# Altium schematic sheet DIO45_TOP.SchDoc
size 297 x 209 mm; Revision: 0.1; SheetNumber: 1; SheetTotal: 5; Title2: DIO45_TOP
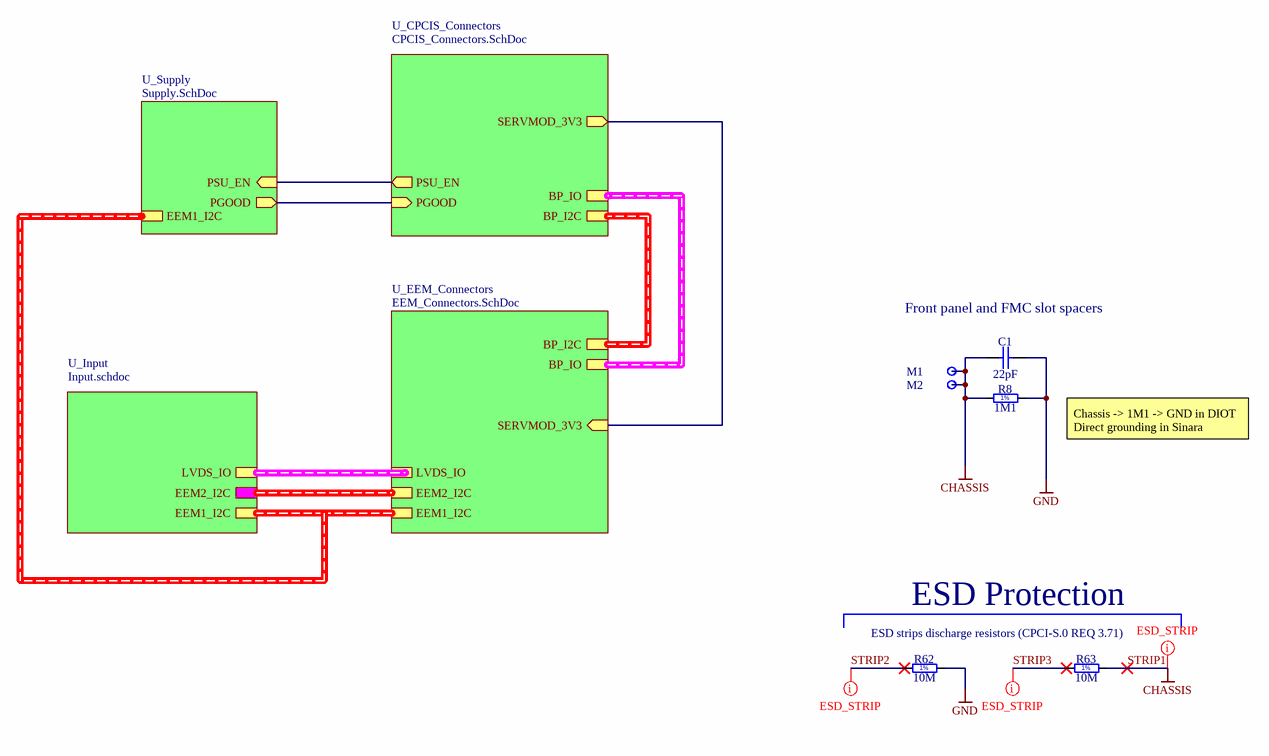
[diagram p0: DIO45_TOP.SchDoc]

## Parts
C1  22pF  [CAPC1005X55N]
M1  Plated Hole  [MTG300_600]  (value not drawn)  (no BOM)
M2  Plated Hole  [MTG300_600]  (value not drawn)  (no BOM)
R8  1M1  [RESC2012X60N]
R62  10M  [RESC2113X55N]
R63  10M  [RESC2113X55N]

## Sub-sheets
U_CPCIS_Connectors = CPCIS_Connectors.SchDoc: BP_I2C (harness I2C), SERVMOD_3V3 (out), BP_IO (harness BP_IO), PSU_EN (out), PGOOD (in)
U_EEM_Connectors = EEM_Connectors.SchDoc: EEM1_I2C (harness I2C), EEM2_I2C (harness I2C), LVDS_IO (harness LVDS_IO), BP_IO (harness BP_IO), BP_I2C (harness I2C), SERVMOD_3V3 (in)
U_Input = Input.schdoc: EEM1_I2C (harness I2C), EEM2_I2C (harness I2C), LVDS_IO (harness LVDS_IO)
U_Supply = Supply.SchDoc: PSU_EN (in), PGOOD (out), EEM1_I2C (harness I2C)

## Nets
GND: C1.2 R8.2 R62.2
STRIP1: C1.1 M1.1 M2.1 R8.1 R63.2  [also labelled CHASSIS]
STRIP2: R62.1
STRIP3: R63.1
(unnamed): sheet U_CPCIS_Connectors/SERVMOD_3V3, sheet U_EEM_Connectors/SERVMOD_3V3
(unnamed): sheet U_CPCIS_Connectors/PSU_EN, sheet U_Supply/PSU_EN
(unnamed): sheet U_CPCIS_Connectors/PGOOD, sheet U_Supply/PGOOD

## Buses and harness runs
harness sheet U_CPCIS_Connectors/BP_I2C = sheet U_EEM_Connectors/BP_I2C
harness sheet U_CPCIS_Connectors/BP_IO = sheet U_EEM_Connectors/BP_IO
harness sheet U_EEM_Connectors/EEM1_I2C = sheet U_Input/EEM1_I2C = sheet U_Supply/EEM1_I2C
harness sheet U_EEM_Connectors/EEM2_I2C = sheet U_Input/EEM2_I2C
harness sheet U_EEM_Connectors/LVDS_IO = sheet U_Input/LVDS_IO

## Layout directives
net class ESD_STRIP: STRIP1, STRIP2, STRIP3

## Notes on the sheet
- Front panel and FMC slot spacers
- Chassis -> 1M1 -> GND in DIOT
  Direct grounding in Sinara
- ESD strips discharge resistors (CPCI-S.0 REQ 3.71)
- ESD Protection
- Project/Equipment
- Document
- Designer
- Drawn by
- Check.by
- Copyright WUT ISE 2024.
  This documentation describes Open Hardware and is licensed under the CERN OHL v.2. You may redistribute and modify this documentation under the terms of the CERN OHL v.2. (http://ohwr.org/CERNOHL). This documentation is distributed WITHOUT ANY EXPRESS OR IMPLIED WARRANTY, INCLUDING OF MERCHANTABILITY, SATISFACTORY QUALITY AND FITNESS FOR A PARTICULAR PURPOSE. Please see the CERN OHL v.2 for applicable conditions.
- Contact
- File
- Last Mod.
- Print Date
- Sheet
- Size
- A3
- of
- Rev
- (in symbol R0805_1M1_1%_0.125W_100PPM) 1%
- (in symbol R0805_10M_1%_0.125W_100PPM_VISHAY_CRCW e3) 1%

## Library data of the parts
C1 = CC0402_22PF_50V_5%_C0G: Non-polarised capacitor; Part Description: SMD Multilayer Chip Ceramic Capacitor; Manufacturer: GENERIC; Manufacturer1 Part Number: C0402C220J5GACTU; Voltage: 50V; TC: C0G/NP0; Tolerance: ±5%; Part Number: CC0402_22PF_50V_5%_C0G; Component Kind: Standard; Component Type: Standard; Pin Count: 2; Value: 22pF; Status: Preferred; Manufacturer Part Number: CC0402_22PF_50V_5%_C0G; Case: 0402; Mounted: Yes; Socket: No; SMD: Yes; Manufacturer1 Example: KEMET; Manufacturer1 ComponentHeight: 0.55mm; HelpURL: \\cern.ch\dfs\Applications\Altium\Datasheets\CC0402_C0G_KEMET_(Commercial Grade).pdf; Author: CERN DEM JLC; CreateDate: 2007-12-03; LatestRevisionDate: 2007-12-03; Sense: No
M1 M2 = PLATED_HOLE3.0_PAD6.0: Single Terminal Socket; Part Description: Plated Through Hole: Hole Dia.=3.0mm Pad Dia.=6.0mm; Mounted: No; Table: Pads; Part Number: PLATED_HOLE3.0_PAD6.0; Component Type: Standard (No BOM); Designator: Single Terminal Socket; Library Reference: Single Terminal Socket; Pin Count: 1; Family: Plated Hole; Socket: No; SMD: No; Status: None; ComponentHeight: 0mm; Author: CERN DEM JLC; CreateDate: 26.05.2008; LatestRevisionDate: 26.05.2008; PackageDescription: Plated Through Hole: Hole Dia.=3.0mm Pad Dia.=6.0mm
R8 = R0805_1M1_1%_0.125W_100PPM: Resistor - 1%; Part Description: General Purpose Thick Film Chip Resistor; Manufacturer: GENERIC; Manufacturer1 Part Number: NRC10F1104TRF; PressFit: No; Part Number: R0805_1M1_1%_0.125W_100PPM; Component Kind: Standard; Component Type: Standard; Pin Count: 2; Value: 1M1; Status: Preferred; Manufacturer Part Number: R0805_1M1_1%_0.125W_100PPM; Case: 0805; Mounted: Yes; Sense: No; Socket: No; SMD: Yes; Manufacturer1 Example: NIC COMPONENT; Manufacturer1 ComponentHeight: 0.6mm; HelpURL: \\cern.ch\dfs\Applications\Altium\Datasheets\R0805_NIC_NRC.pdf; Author: CERN DEM JLC; CreateDate: 03/12/2007; LatestRevisionDate: 13/03/2008
R62 R63 = R0805_10M_1%_0.125W_100PPM_VISHAY_CRCW e3: Resistor - 1%; Part Description: 150V, Standard Thick Film Chip Resistor; Manufacturer: VISHAY DALE; Manufacturer Part Number: CRCW080510M0FKEA; Power: 0.125W; TC: ±100ppm/°C; PressFit: No; Part Number: R0805_10M_1%_0.125W_100PPM_VISHAY_CRCW e3; Component Kind: Standard; Component Type: Standard; Pin Count: 2; Value: 10M; Status: None; Tolerance: ±1%; Case: 0805; Mounted: Yes; Sense: No; Socket: No; SMD: Yes; ComponentHeight: 0.5mm; HelpURL: \\cern.ch\dfs\Applications\Altium\Datasheets\R0805_VISHAY_CRCW e3.pdf; Author: CERN DEM BC; CreateDate: 2019-11-12; LatestRevisionDate: 2019-11-12